# EAGLE design cactar (EAGLE 6.5.0)
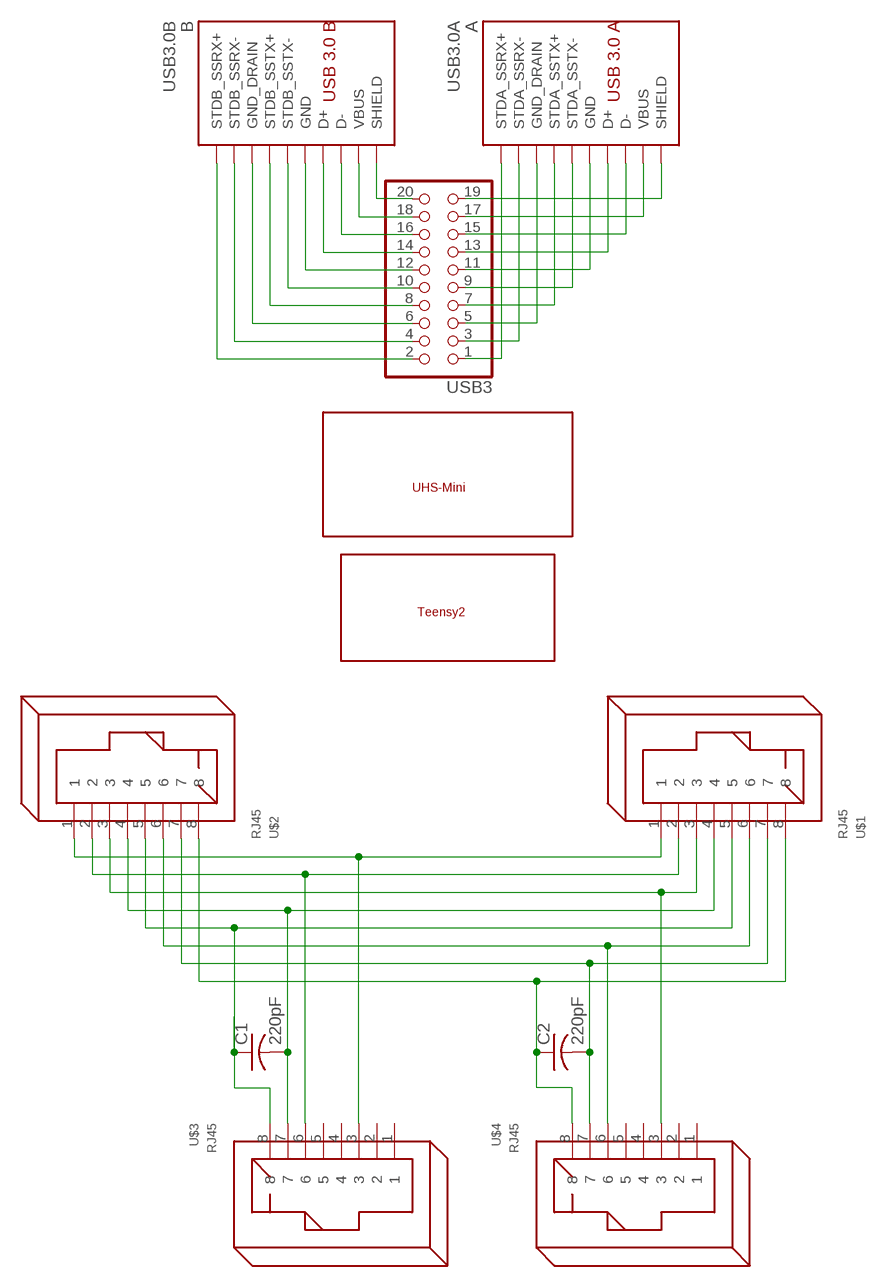
[diagram p0: schematic, sheet 1]

## Parts
_1  TEENSY2  [TEENSY2]
A  USB3.0A  [AMPHENOLUSB3.0A]
B  USB3.0B  [AMPHENOLUSB3.0B]
C1  220pF  C-US050-025X075  [C050-025X075]
C2  220pF  C-US050-025X075  [C050-025X075]
U$1  RJ45  [RJ45]
U$2  RJ45  [RJ45]
U$3  RJ45  [RJ45]
U$4  RJ45  [RJ45]
U$5  BREADLY  [BREADLY]
USB3  PINHD-2X102X10/MIRROR  [2X10/MIRROR]

## Nets
N$1: U$1.1 U$2.1 U$3.3
N$2: U$1.2 U$2.2 U$3.6
N$3: U$1.3 U$2.3 U$4.3
N$4: C1.2 U$1.4 U$2.4 U$3.7
N$5: C1.1 U$1.5 U$2.5 U$3.8
N$6: U$1.6 U$2.6 U$4.6
N$7: C2.2 U$1.7 U$2.7 U$4.7
N$8: C2.1 U$1.8 U$2.8 U$4.8
N$9 [power]: B.10@1(SHIELD) B.10@2(SHIELD) USB3.20
N$20 [power]: A.10@1(SHIELD) A.10@2(SHIELD) USB3.19
N$22 [power]: A.1(VBUS) USB3.17
N$23: A.2(D-) USB3.15
N$24: A.3(D+) USB3.13
N$25 [power]: A.4(GND) USB3.11
N$26: A.8(STDA_SSTX-) USB3.9
N$27: A.9(STDA_SSTX+) USB3.7
N$28: A.7(GND_DRAIN) USB3.5
N$29: A.5(STDA_SSRX-) USB3.3
N$30: A.6(STDA_SSRX+) USB3.1
N$31: B.9(STDB_SSRX+) USB3.2
N$32: B.8(STDB_SSRX-) USB3.4
N$33: B.7(GND_DRAIN) USB3.6
N$34: B.6(STDB_SSTX+) USB3.8
N$35: B.5(STDB_SSTX-) USB3.10
N$36 [power]: B.4(GND) USB3.12
N$37: B.3(D+) USB3.14
N$38: B.2(D-) USB3.16
N$39 [power]: B.1(VBUS) USB3.18
Unconnected: U$3.1 U$3.2 U$3.4 U$3.5 U$4.1 U$4.2 U$4.4 U$4.5

## Library data of the parts
_1 = teensy:TEENSY2
A = AlexW-Eagle-Libraries:USB3.0A: Usb3.0A Amphenol USB 3.0 A jack
B = AlexW-Eagle-Libraries:USB3.0B: USB3.0B Amphenol USB 3.0 B connector
C1 C2 = rcl:C-US: CAPACITOR, American symbol
U$1-U$4 = con-rj:RJ45: RJ45 RJ45 jacks side mounted http://www.tycoelectronics.com
U$5 = teensy:BREADLY
USB3 = pinhead:PINHD-2X10: PIN HEADER

## Net classes
0 default: width 0.305 mm
1 power: width 0.61 mm

## Board
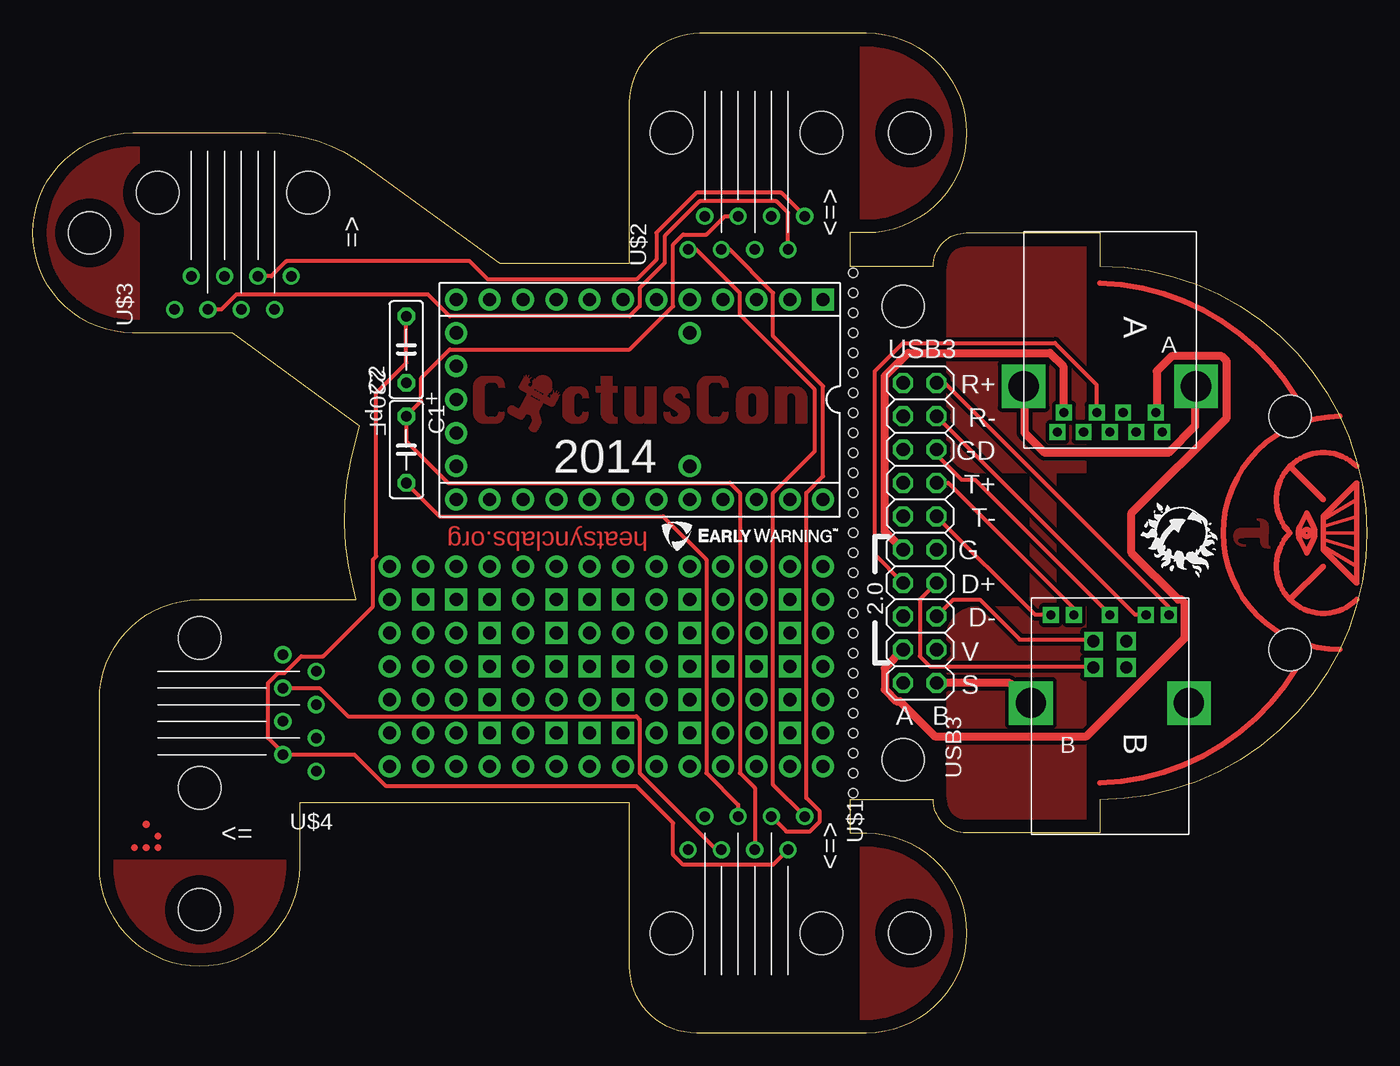
[diagram p1: board, top side]
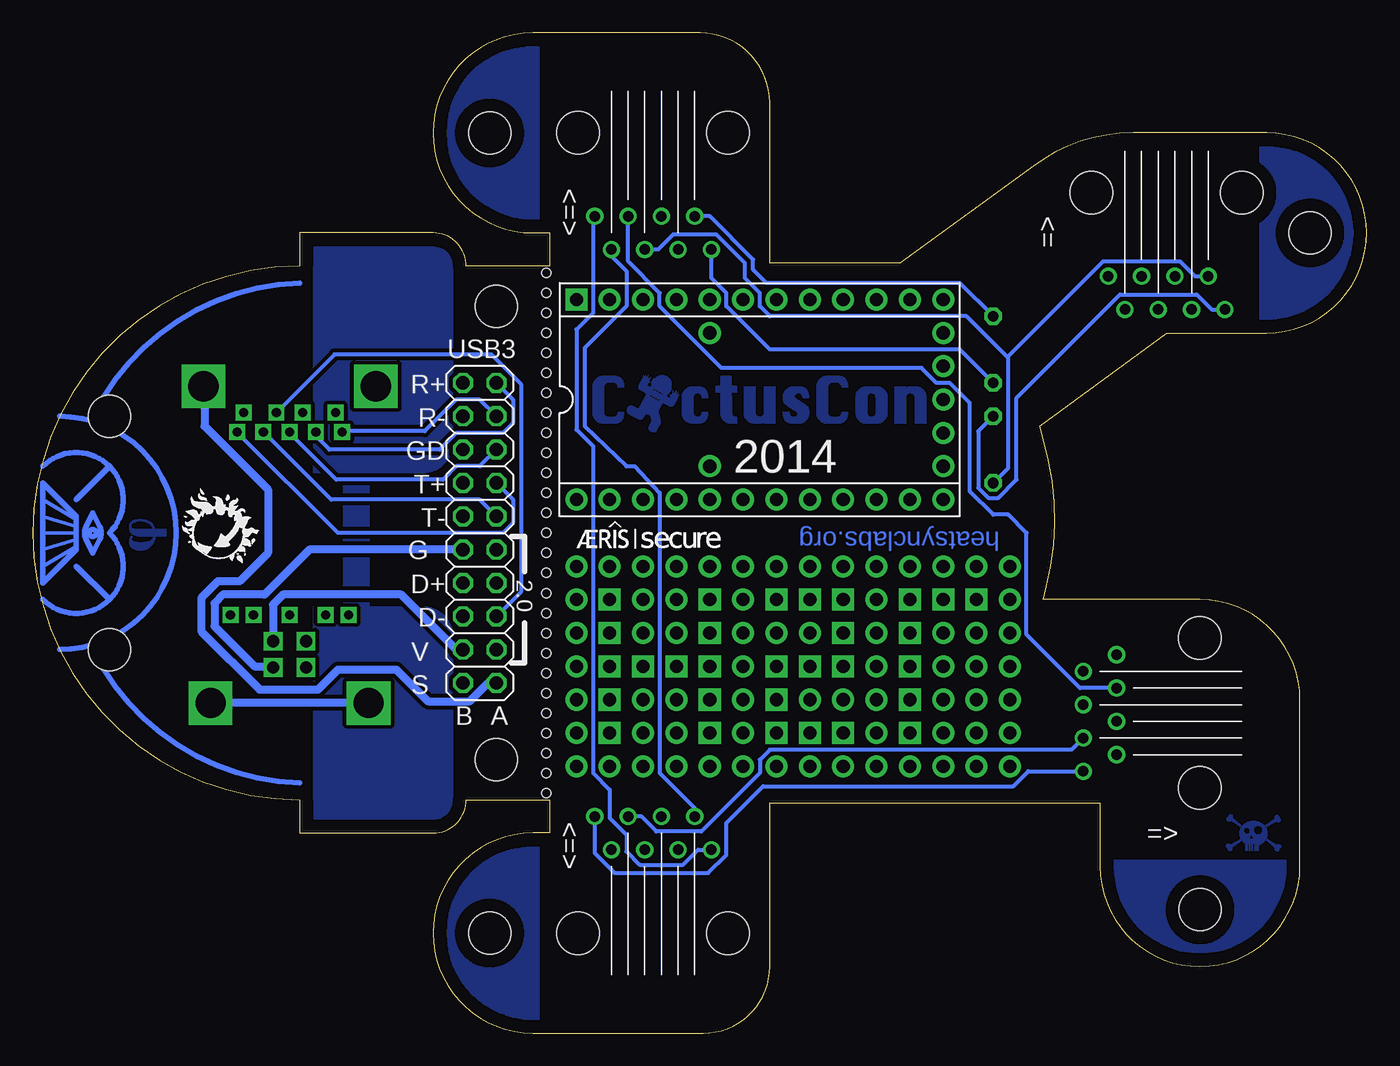
[diagram p2: board, bottom side, seen from below]

Size 101.6 x 76.2 mm. Coordinates in mm from the lower left corner, seen from the top.
Outline: 62.23,58.42 68.58,58.42 arc-90 71.12,60.96 81.28,60.96 81.28,58.42 arc-90 101.6,38.1 arc-90 81.28,17.78 81.28,15.24 71.12,15.24 arc-90 68.58,17.78 62.23,17.78 62.23,15.24 63.5,15.24 arc-90 71.12,7.62 arc-90 63.5,0 50.55,0 arc-90 45.47,5.08 45.47,17.53 20.32,17.53 20.32,12.7 arc-90 12.7,5.08 arc-90 5.08,12.7 5.08,25.4 arc-90 12.7,33.02 24.64,33.02 24.38,34.04 arc-31 24.64,45.21 24.89,46.23 15.24,53.34 7.62,53.34 arc-90 0,60.96 arc-90 7.62,68.58 17.78,68.58 arc-37 25.4,66.04 35.56,58.67 45.47,58.67 45.47,70.87 arc-90 50.8,76.2 63.5,76.2 arc-90 71.12,68.58 arc-90 63.5,60.96 62.23,60.96 62.23,58.42
Copper layers (1*16): Top 0.035mm / dielectric 1.5mm / Bottom 0.035mm
Design rules "default *": minimum track width 12mil, minimum drill 24mil, track to track 12mil, track to pad 10mil, pad to pad 10mil, via to via 12mil, smd to smd 10mil, copper to edge 40mil, drill to drill 8mil, minimum pad ring 10mil, minimum via ring 8mil, stop-mask expansion 4mil, vias tented up to drill 0mil, thermal gap 10mil
Holes 3.2 mm at 4.32,60.96 12.7,9.4 66.8,68.58 66.8,7.62 95.76,46.99 66.29,55.37 66.29,20.83 95.76,29.21
Holes 0.7 mm at 62.48,57.91 62.48,56.39 62.48,54.86 62.48,53.34 62.48,51.82 62.48,50.29 62.48,48.77 62.48,47.24 62.48,45.72 62.48,44.2 62.48,42.67 62.48,41.15 62.48,39.62 62.48,38.1 62.48,36.58 62.48,35.05 62.48,33.53 62.48,32 62.48,30.48 62.48,28.96 62.48,27.43 62.48,25.91 62.48,24.38 62.48,22.86 62.48,21.34 62.48,19.81 62.48,18.29

### Footprints (pad centres in the part's own frame; a part is rotated, then mirrored left to right if it is on the bottom)
TEENSY2 = drill 1 pad 1.676: P$1 11.43,7.62; P$2 8.89,7.62; P$3 6.35,7.62; P$4 3.81,7.62; P$5 1.27,7.62; P$6 -1.27,7.62; P$7 -3.81,7.62; P$8 -6.35,7.62; P$9 -8.89,7.62; P$10 -11.43,7.62; P$11 -13.97,7.62; P$12 13.97,7.62; P$13 13.97,5.08; P$14 13.97,2.54; P$15 13.97,0; P$16 13.97,-2.54; P$17 13.97,-5.08; P$18 13.97,-7.62; P$19 11.43,-7.62; P$20 8.89,-7.62; P$21 6.35,-7.62; P$22 3.81,-7.62; P$23 1.27,-7.62; P$24 -1.27,-7.62; P$25 -3.81,-7.62; P$26 -6.35,-7.62; P$27 -8.89,-7.62; P$28 -11.43,-7.62; P$29 -3.81,-5.08; P$30 -3.81,5.08 | drill 1 pad 1.676 square: P$31 -13.97,-7.62
AMPHENOLUSB3.0A = drill 0.7 square: 1 -3.5,2; 2 -1,2; 3 1,2; 4 3.5,2; 5 4,3.5; 6 2,3.5; 7 0,3.5; 8 -2,3.5; 9 -4,3.5 | drill 2.3 square: 10@1 -6.57,0; 10@2 6.57,0
AMPHENOLUSB3.0B = drill 0.92 square: 1 1.25,4.71; 2 -1.25,4.71; 3 -1.25,2.71; 4 1.25,2.71 | drill 0.7 square: 5 -4.5,6.71; 6 -2.75,6.71; 7 0,6.71; 8 2.75,6.71; 9 4.5,6.71 | drill 2.3 square: 10@1 -6.02,0; 10@2 6.02,0
C050-025X075 = drill 0.813 octagon: 1 -2.54,0; 2 2.54,0
RJ45 = drill 0.8: 1 -6.35,-4.445; 2 -8.89,-3.175; 3 -6.35,-1.905; 4 -8.89,-0.635; 5 -6.35,0.635; 6 -8.89,1.905; 7 -6.35,3.175; 8 -8.89,4.445 | hole 3.25: 0,-5.715; 0,5.715
BREADLY = drill 1 pad 1.676: P$1 17.78,7.62; P$2 15.24,7.62; P$3 12.7,7.62; P$4 10.16,7.62; P$5 7.62,7.62; P$6 5.08,7.62; P$7 2.54,7.62; P$8 0,7.62; P$9 -2.54,7.62; P$10 -5.08,7.62; P$11 -7.62,7.62; P$12 -10.16,7.62; P$13 17.78,-7.62; P$14 15.24,-7.62; P$15 12.7,-7.62; P$16 10.16,-7.62; P$17 7.62,-7.62; P$18 5.08,-7.62; P$19 2.54,-7.62; P$20 0,-7.62; P$21 -2.54,-7.62; P$22 -5.08,-7.62; P$23 -7.62,-7.62; P$24 -10.16,-7.62; P$25 -10.16,2.54; P$26 -7.62,2.54; P$27 0,-2.54; P$28 -2.54,-2.54; P$29 2.54,2.54; P$30 5.08,2.54; P$31 -7.62,5.08; P$32 2.54,-2.54; P$33 12.7,-2.54; P$34 15.24,-2.54; P$35 -2.54,5.08; P$36 12.7,5.08; P$37 15.24,5.08; P$38 -2.54,2.54; P$39 12.7,2.54; P$40 15.24,2.54; P$41 17.78,5.08; P$42 17.78,2.54; P$43 17.78,0; P$44 17.78,-2.54; P$45 -10.16,5.08; P$46 -2.54,0; P$47 -2.54,-5.08; P$48 7.62,5.08; P$49 7.62,2.54; P$50 -7.62,-2.54; P$51 -7.62,-5.08; P$57 -12.7,7.62; P$59 -15.24,7.62; P$60 -15.24,5.08; P$61 -15.24,2.54; P$63 7.62,-5.08; P$70 -10.16,-5.08; P$71 7.62,-2.54; P$78 -10.16,-2.54; P$80 -15.24,-2.54; P$82 -15.24,-5.08; P$83 -12.7,-7.62; P$84 -15.24,-7.62; P$86 12.7,0; P$87 15.24,0; P$88 17.78,-5.08; P$89 7.62,0; P$98 -15.24,0 | drill 1 pad 1.676 square: P$52 -12.7,5.08; P$53 -12.7,2.54; P$54 -12.7,0; P$55 -12.7,-2.54; P$56 -12.7,-5.08; P$58 -10.16,0; P$62 -7.62,0; P$64 -5.08,-5.08; P$65 -5.08,-2.54; P$66 -5.08,0; P$67 -5.08,2.54; P$68 -5.08,5.08; P$69 5.08,5.08; P$72 2.54,5.08; P$73 0,5.08; P$74 0,2.54; P$75 0,0; P$76 2.54,0; P$77 5.08,0; P$79 5.08,-2.54; P$81 5.08,-5.08; P$85 2.54,-5.08; P$90 0,-5.08; P$91 10.16,5.08; P$92 10.16,2.54; P$93 10.16,0; P$94 10.16,-2.54; P$95 10.16,-5.08; P$96 12.7,-5.08; P$97 15.24,-5.08
2X10/MIRROR = drill 1.016 octagon: 1 -11.43,-1.27; 2 -11.43,1.27; 3 -8.89,-1.27; 4 -8.89,1.27; 5 -6.35,-1.27; 6 -6.35,1.27; 7 -3.81,-1.27; 8 -3.81,1.27; 9 -1.27,-1.27; 10 -1.27,1.27; 11 1.27,-1.27; 12 1.27,1.27; 13 3.81,-1.27; 14 3.81,1.27; 15 6.35,-1.27; 16 6.35,1.27; 17 8.89,-1.27; 18 8.89,1.27; 19 11.43,-1.27; 20 11.43,1.27

### Placement (x,y rotation side)
_1  46.23,48.26 180 top
A  82.04,49.28 180 top
B  82.04,25.15 0 top
C1  28.45,44.45 270 top
C2  28.45,52.07 90 top
U$1  54.36,7.62 270 top
U$2  54.36,68.58 90 top
U$3  15.24,64.01 90 top
U$4  12.7,24.38 180 top
U$5  44.96,27.94 180 top
USB3  67.56,38.1 270 top

### Tracks (layer width: path | path; a pad name or v marks a point on that pad's centre or on a via)
N$1
  Top 0.305: U$3.3 18.16,57.66 19.3,58.8 33.27,58.8 34.67,57.4 45.97,57.4 47.5,58.93 47.5,60.96 50.55,64.01 57.02,64.01 U$2.1
  Bottom 0.305: U$1.1 50.93,13.97 52.07,12.83 55.37,12.83 56.39,13.84 56.39,15.11 57.66,16.38 57.66,18.54 58.93,19.81 58.93,44.7 60.2,45.97 60.2,53.59 58.93,54.86 58.93,62.1 U$2.1
N$2
  Top 0.305: U$3.6 14.35,55.12 15.49,56.26 30.1,56.26 31.75,54.61 45.47,54.61 46.23,55.37 46.23,56.77 48.13,58.67 48.13,60.71 50.8,63.37 56.64,63.37 57.53,62.48 U$2.2
  Bottom 0.305: U$1.2 51.18,17.14 53.85,19.81 53.85,41.15 55.75,43.18 56.39,43.18 59.56,46.23 59.56,52.2 56.39,55.37 56.39,58.04 57.53,59.18 U$2.2
N$3
  Top 0.305: U$1.3 52.07,13.97 46.23,19.81 46.23,23.88 45.97,24.13 24,24.13 21.84,26.29 U$4.3
  Bottom 0.305: U$2.3 56.26,58.8 53.85,56.39 53.85,55.37 49.15,50.67 33.91,50.67 32.77,49.53 31.75,49.53 30.23,48.01 30.23,41.27 28.45,39.5 27.3,39.5 25.91,38.1 25.91,30.35 21.84,26.29 U$4.3
N$4
  Top 0.305: U$1.4 53.72,17.4 51.31,19.81 51.31,36.07 48.01,39.37 30.99,39.37 C1.2
  Bottom 0.305: U$3.7 13.08,57.66 14.22,58.8 20.07,58.8 27.3,51.56 | 27.3,51.56 27.3,43.05 C1.2 | U$2.4 53.97,59.69 52.83,60.83 49.53,60.83 47.37,58.67 47.37,57.53 46.23,56.39 46.23,55.37 45.47,54.61 30.48,54.61 27.43,51.56 27.3,51.56
N$5
  Top 0.305: U$2.5 52.7,62.23 51.31,60.83 49.53,60.83 48.77,60.07 48.77,55.37 45.47,52.07 31.75,52.07 29.59,49.91 29.59,48.13 C1.1 28.45,45.08 31.62,41.91 53.09,41.91 53.85,41.15 53.85,19.81 54.99,18.67 U$1.5
  Bottom 0.305: U$3.8 11.81,55.12 12.95,56.26 18.8,56.26 26.67,48.39 26.67,42.16 28.07,40.77 28.83,40.77 29.59,41.53 29.59,45.85 C1.1
N$6
  Top 0.305: U$2.6 53.09,59.69 56.39,56.39 56.39,53.09 60.2,49.28 60.2,42.42 58.93,41.15 58.93,17.91 59.94,16.89 59.94,16.13 59.18,15.37 57.4,15.37 U$1.6
  Bottom 0.305: U$1.6 55.24,16.51 54.1,15.37 50.67,15.37 46.23,19.81 46.23,20.83 45.47,21.59 22.48,21.59 U$4.6
N$7
  Top 0.305: U$1.7 56.39,12.83 49.53,12.83 48.77,13.59 48.77,16 45.97,18.8 26.92,18.8 24.51,21.21 U$4.7 19.05,21.34 17.91,22.48 17.91,26.67 18.67,27.43 19.18,27.43 20.45,28.7 22.1,28.7 25.91,32.51 25.91,36.07 26.16,36.32 26.16,48.77 28.45,51.05 C2.2
  Bottom 0.305: U$2.7 50.04,62.23 46.74,58.93 46.74,58.17 45.72,57.15 30.99,57.15 C2.2
N$8
  Top 0.305: U$2.8 50.55,59.69 53.85,56.39 53.85,54.74 59.56,49.02 59.56,44.32 56.39,41.15 56.39,18.92 U$1.8
  Bottom 0.305: U$2.8 49.91,57.53 48.77,56.39 48.77,55.37 45.47,52.07 30.99,52.07 C2.1 | U$4.8 25.78,19.94 26.92,18.8 45.97,18.8 48.77,16 48.77,13.59 50.16,12.19 57.28,12.19 58.8,13.72 U$1.8
N$9
  Top 0.61: USB3.20 74.42,26.67 75.95,25.15 B.10@1
  Bottom 0.61: B.10@1 B.10@2
N$10
  Bottom 0.406: 95.76,38.1 arc-90 95.76,43.18 | 95.76,43.18 arc-90 100.84,43.18 | 95.76,43.18 98.3,40.64
N$11
  Bottom 0.406: 100.84,33.02 arc-90 95.76,33.02 | 95.76,33.02 arc-90 95.76,38.1 | 95.76,33.02 98.3,35.56
N$12
  Top 0.406: 95.76,38.1 arc-90 95.76,43.18 | 95.76,43.18 arc-90 100.84,43.18 | 95.76,43.18 98.3,40.64
N$13
  Top 0.406: 100.84,33.02 arc-90 95.76,33.02 | 95.76,33.02 arc-90 95.76,38.1 | 95.76,33.02 98.3,35.56
N$14
  pour Bottom: 80.26,60.2 71.37,60.2 arc90 69.6,58.42 69.6,44.96 arc90 71.88,42.67 75.95,42.67 75.95,32.51 71.88,32.51 arc90 69.6,30.23 69.6,17.78 arc90 71.37,16 80.26,16 80.26,32.51 77.98,32.51 77.98,42.67 80.26,42.67
  pour Top: 80.26,60.2 71.37,60.2 arc90 69.6,58.42 69.6,44.96 arc90 71.88,42.67 75.95,42.67 75.95,32.51 71.88,32.51 arc90 69.6,30.23 69.6,17.78 arc90 71.37,16 80.26,16 80.26,32.51 77.98,32.51 77.98,42.67 80.26,42.67
N$18
  pour Bottom: 62.99,61.72 63.5,61.72 arc90 70.36,68.58 arc94 62.99,75.44
  pour Top: 62.99,61.72 63.5,61.72 arc90 70.36,68.58 arc94 62.99,75.44
N$19
  pour Bottom: 8.13,67.82 7.62,67.82 arc90 0.76,60.96 arc94 8.13,54.1
  pour Top: 8.13,67.82 7.62,67.82 arc90 0.76,60.96 arc94 8.13,54.1
N$20
  Top 0.61: A.10@2 75.56,49.28 75.56,45.72 77.09,44.2 86.49,44.2 88.52,46.23 88.52,49.28 A.10@1
  Bottom 0.61: USB3.19 66.93,26.67 68.33,25.27 71.5,25.27 73.91,27.69 78.36,27.69 79.88,26.16 84.33,26.16 88.77,30.61 88.77,33.15 87.5,34.42 85.85,34.42 83.69,36.58 83.69,41.4 88.52,46.23 88.52,49.28 A.10@1
N$22
  Top 0.61: USB3.17 64.9,27.81 64.9,26.16 65.79,25.27 66.04,25.27 68.71,22.61 80.26,22.61 87.76,30.1 87.76,32.77 87.5,33.02 87.25,33.02 83.69,36.58 83.69,39.62 90.93,46.86 90.93,51.18 90.55,51.56 86.74,51.56 85.6,50.42 85.6,47.37 A.1
N$23
  Bottom 0.305: USB3.15 64.39,33.66 64.39,49.4 66.67,51.69 78.61,51.69 82.93,47.37 A.2
N$24
  Top 0.305: USB3.13 64.14,36.45 64.14,50.42 66.29,52.58 77.85,52.58 81.03,49.4 81.03,47.37 A.3
N$25
  Top 0.61: USB3.11 64.9,38.23 64.9,50.04 66.67,51.82 77.47,51.82 78.49,50.8 78.49,47.37 A.4
N$26
  Bottom 0.305: USB3.9 67.56,40.64 78.87,40.64 83.95,45.72 A.8
N$27
  Bottom 0.305: USB3.7 65.02,40.64 65.02,38.86 65.79,38.1 78.36,38.1 85.98,45.72 A.9
N$28
  Bottom 0.305: USB3.5 67.56,43.18 69.34,43.18 70.36,42.16 78.49,42.16 82.04,45.72 A.7
N$29
  Bottom 0.305: USB3.3 67.56,48.26 69.34,48.26 71.76,45.85 77.98,45.85 A.5
N$30
  Bottom 0.305: USB3.1 65.02,48.26 65.02,46.48 65.79,45.72 69.34,45.72 70.61,44.45 78.99,44.45 80.01,45.47 80.01,45.72 A.6
N$31
  Top 0.305: USB3.2 69.47,49.53 86.49,32.51 86.49,31.88 B.9
N$32
  Top 0.305: USB3.4 83.95,31.88 84.71,31.88 B.8
N$33
  Top 0.305: USB3.6 68.83,44.07 70.74,42.16 71.76,42.16 82.04,31.88 B.7
N$34
  Top 0.305: USB3.8 69.72,41.91 79.25,32.39 79.25,31.88 B.6
N$35
  Top 0.305: USB3.10 76.33,31.88 77.47,31.88 B.5
N$36
  Bottom 0.61: USB3.12 80.52,36.83 83.95,33.4 87.12,33.4 87.76,32.77 87.76,30.99 84.71,27.94 83.31,27.94 B.4
N$37
  Top 0.305: USB3.14 67.56,33.02 67.56,28.7 68.33,27.94 80.77,27.94 B.3
N$38
  Top 0.305: USB3.16 70.1,33.02 72.14,33.02 75.18,29.97 80.77,29.97 B.2
N$39
  Bottom 0.61: USB3.18 69.34,29.21 73.53,33.4 82.55,33.4 83.31,32.64 83.31,29.97 B.1
N$40
  pour Bottom: 5.84,13.21 5.84,12.7 arc90 12.7,5.84 arc94 19.56,13.21
  pour Top: 5.84,13.21 5.84,12.7 arc90 12.7,5.84 arc94 19.56,13.21
N$41
  pour Bottom: 62.99,0.76 63.5,0.76 arc90 70.36,7.62 arc94 62.99,14.48
  pour Top: 62.99,0.76 63.5,0.76 arc90 70.36,7.62 arc94 62.99,14.48
N$42
  Bottom 0.406: 96.52,38.61 97.03,39.62 97.54,38.61 arc-53 97.54,37.59 97.03,36.58 96.52,37.59 arc-53 96.52,38.61
N$43  (1 unrouted)
  Top 0.406: 99.57,46.99 arc180 99.57,29.21
  Bottom 0.406: 99.57,46.99 arc180 99.57,29.21
N$44  (1 unrouted)
  Top 0.406: 81.28,57.15 arc-62 97.03,46.99
  Bottom 0.406: 81.28,57.15 arc-62 97.03,46.99
N$45  (1 unrouted)
  Top 0.406: 81.28,19.05 arc62 97.03,29.21
  Bottom 0.406: 81.28,19.05 arc62 97.03,29.21
N$46
  Bottom 0.254: 98.3,39.12 100.84,40.64 | 98.3,38.61 100.84,39.37 | 98.3,38.1 100.84,38.1 | 98.3,37.59 100.84,36.83 | 98.3,37.08 100.84,35.56
  Bottom 0.406: 100.84,41.91 100.84,40.64 100.84,39.37 100.84,38.1 100.84,36.83 100.84,35.56 100.84,34.29 98.3,36.83 98.3,37.08 98.3,37.59 98.3,38.1 98.3,38.61 98.3,39.12 98.3,39.37 100.84,41.91
N$47
  Top 0.254: 98.3,38.1 100.84,38.1 | 98.3,37.59 100.84,36.83 | 98.3,37.08 100.84,35.56 | 98.3,38.61 100.84,39.37 | 98.3,39.12 100.84,40.64
  Top 0.406: 100.84,41.91 100.84,40.64 100.84,39.37 100.84,38.1 100.84,36.83 100.84,35.56 100.84,34.29 98.3,36.83 98.3,37.08 98.3,37.59 98.3,38.1 98.3,38.61 98.3,39.12 98.3,39.37 100.84,41.91
N$48
  Top 0.406: 96.52,38.61 97.03,39.62 97.54,38.61 arc-53 97.54,37.59 97.03,36.58 96.52,37.59 arc-53 96.52,38.61
N$49
  pour Bottom: 451 corners
N$50
  pour Bottom: 869 corners
N$51
  pour Top: 331 corners
N$52
  pour Bottom: 567 corners
N$53
  pour Bottom: 49.23,50.06 49.23,49.29 49.6,49.29 49.6,48.79 49.23,48.79 49.23,47.84 49.23,47.82 49.23,47.74 49.23,47.72 49.23,47.68 49.23,47.66 49.23,47.62 49.23,47.6 49.23,47.55 49.23,47.53 49.23,47.51 49.23,47.49 49.23,47.47 49.23,47.43 49.23,47.41 49.23,47.39 49.23,47.37 49.23,47.35 49.23,47.33 49.23,47.3 49.23,47.28 49.23,47.26 49.23,47.24 49.23,47.22 49.22,47.2 49.22,47.18 49.22,47.16 49.22,47.14 49.22,47.12 49.22,47.1 49.21,47.08 49.21,47.06 49.2,47.04 49.2,47.02 49.19,47 49.18,46.98 49.17,46.96 49.17,46.94 49.16,46.93 49.15,46.91 49.14,46.89 49.13,46.87 49.12,46.85 49.11,46.83 49.1,46.82 49.09,46.8 49.08,46.78 49.07,46.77 49.05,46.75 49.04,46.74 49.03,46.72 49.01,46.7 49,46.69 48.99,46.68 48.97,46.66 48.96,46.65 48.94,46.63 48.93,46.62 48.91,46.61 48.89,46.59 48.88,46.58 48.86,46.57 48.84,46.56 48.83,46.55 48.81,46.54 48.79,46.53 48.77,46.52 48.76,46.51 48.74,46.5 48.72,46.49 48.7,46.48 48.68,46.47 48.66,46.47 48.64,46.46 48.62,46.45 48.6,46.45 48.58,46.44 48.56,46.44 48.54,46.44 48.52,46.44 48.5,46.44 48.48,46.44 48.46,46.44 48.44,46.44 48.42,46.43 48.4,46.43 48.38,46.43 48.36,46.43 48.34,46.43 48.32,46.43 48.3,46.43 48.28,46.43 48.26,46.43 48.18,46.43 48.16,46.43 48.1,46.43 48.08,46.43 48,46.43 47.98,46.43 47.98,46.93 48,46.93 48.02,46.93 48.03,46.93 48.05,46.93 48.07,46.94 48.09,46.94 48.11,46.94 48.13,46.94 48.15,46.95 48.17,46.96 48.19,46.97 48.21,46.98 48.22,46.99 48.24,47 48.25,47.02 48.27,47.03 48.28,47.05 48.29,47.06 48.3,47.08 48.31,47.1 48.32,47.11 48.34,47.12 48.35,47.14 48.36,47.15 48.36,47.19 48.36,47.21 48.36,47.28 48.36,47.3 48.36,47.36 48.36,47.38 48.36,47.46 48.36,47.48 48.36,47.54 48.36,47.56 48.36,47.62 48.36,47.64 48.36,47.73 48.36,47.75 48.36,47.81 48.36,47.83 48.36,47.89 48.36,47.91 48.36,47.99 48.36,48.01 48.36,48.07 48.36,48.09 48.36,48.18 48.36,48.2 48.36,48.26 48.36,48.28 48.36,48.36 48.36,48.38 48.36,48.44 48.36,48.46 48.36,48.53 48.36,48.55 48.36,48.63 48.36,48.65 48.36,48.71 48.36,48.73 48.36,48.79 47.98,48.79 47.98,49.29 48.36,49.29 48.36,50.06
N$54
  pour Bottom: 47.44,49.26 47.44,47.79 47.44,47.77 47.44,47.65 47.44,47.63 47.44,47.57 47.44,47.55 47.44,47.53 47.44,47.51 47.44,47.48 47.44,47.46 47.44,47.44 47.44,47.42 47.44,47.4 47.44,47.38 47.44,47.36 47.44,47.34 47.44,47.32 47.44,47.3 47.44,47.28 47.43,47.26 47.43,47.24 47.43,47.22 47.43,47.19 47.43,47.17 47.43,47.15 47.43,47.13 47.42,47.11 47.42,47.09 47.42,47.07 47.41,47.05 47.41,47.03 47.4,47.01 47.4,46.99 47.39,46.97 47.38,46.95 47.38,46.93 47.37,46.91 47.36,46.9 47.35,46.88 47.34,46.86 47.33,46.84 47.32,46.83 47.31,46.81 47.29,46.8 47.28,46.78 47.27,46.77 47.26,46.75 47.25,46.74 47.23,46.72 47.22,46.71 47.21,46.69 47.18,46.66 47.15,46.64 47.13,46.62 47.12,46.61 47.1,46.6 47.09,46.59 47.07,46.57 47.05,46.56 47.04,46.55 47.02,46.54 47,46.53 46.99,46.52 46.97,46.51 46.95,46.5 46.93,46.49 46.91,46.49 46.89,46.48 46.88,46.47 46.86,46.47 46.84,46.46 46.82,46.46 46.8,46.45 46.78,46.45 46.76,46.44 46.74,46.44 46.72,46.44 46.7,46.44 46.68,46.44 46.66,46.44 46.64,46.44 46.62,46.43 46.6,46.43 46.58,46.43 46.56,46.43 46.54,46.43 46.52,46.43 46.5,46.43 46.46,46.43 46.44,46.43 46.37,46.43 46.35,46.43 46.31,46.43 46.29,46.43 46.27,46.43 46.25,46.43 46.23,46.43 46.21,46.43 46.18,46.44 46.16,46.44 46.14,46.44 46.12,46.44 46.1,46.45 46.08,46.45 46.06,46.46 46.04,46.46 46.02,46.47 46,46.48 45.99,46.49 45.97,46.5 45.95,46.51 45.93,46.53 45.92,46.54 45.9,46.55 45.9,46.43 45.01,46.43 45.01,49.26 45.9,49.26 45.9,47.19 45.91,47.17 45.92,47.15 45.93,47.13 45.94,47.12 45.95,47.1 45.96,47.08 45.97,47.07 45.98,47.05 45.99,47.04 46.01,47.03 46.02,47.01 46.03,47 46.05,46.99 46.07,46.98 46.08,46.97 46.1,46.96 46.12,46.95 46.13,46.95 46.15,46.94 46.17,46.94 46.19,46.94 46.21,46.94 46.23,46.94 46.25,46.94 46.27,46.94 46.28,46.94 46.3,46.94 46.32,46.95 46.34,46.95 46.36,46.96 46.37,46.97 46.39,46.98 46.41,46.99 46.42,47 46.44,47.01 46.45,47.03 46.46,47.04 46.47,47.05 46.49,47.07 46.5,47.08 46.51,47.1 46.52,47.12 46.53,47.13 46.54,47.15 46.55,47.17 46.55,47.19 46.55,49.26
N$55
  pour Bottom: 487 corners
N$56
  pour Bottom: 489 corners
N$57
  pour Bottom: 272 corners
N$58
  pour Bottom: 35.97,49.26 35.97,46.43 35.08,46.43 35.08,48.5 35.07,48.52 35.06,48.54 35.05,48.56 35.04,48.57 35.03,48.59 35.02,48.61 35.01,48.62 35,48.64 34.99,48.65 34.98,48.66 34.96,48.68 34.95,48.69 34.93,48.7 34.92,48.71 34.9,48.72 34.88,48.73 34.87,48.74 34.85,48.74 34.83,48.75 34.81,48.75 34.79,48.75 34.77,48.75 34.74,48.75 34.72,48.75 34.7,48.75 34.68,48.75 34.66,48.74 34.64,48.74 34.62,48.73 34.61,48.72 34.59,48.71 34.58,48.7 34.56,48.69 34.55,48.68 34.53,48.66 34.52,48.65 34.51,48.64 34.5,48.62 34.48,48.61 34.47,48.59 34.47,48.57 34.46,48.56 34.45,48.54 34.44,48.52 34.43,48.5 34.43,46.43 33.54,46.43 33.54,47.87 33.54,47.9 33.54,48.04 33.54,48.06 33.54,48.1 33.54,48.12 33.54,48.16 33.54,48.19 33.54,48.21 33.54,48.23 33.54,48.25 33.54,48.27 33.54,48.29 33.54,48.31 33.54,48.33 33.54,48.35 33.55,48.37 33.55,48.39 33.55,48.41 33.55,48.43 33.55,48.45 33.55,48.47 33.55,48.49 33.55,48.52 33.55,48.54 33.56,48.56 33.56,48.58 33.56,48.6 33.56,48.62 33.57,48.64 33.57,48.66 33.58,48.68 33.58,48.7 33.59,48.72 33.6,48.74 33.61,48.76 33.62,48.77 33.62,48.79 33.63,48.81 33.64,48.83 33.65,48.85 33.66,48.86 33.68,48.88 33.69,48.9 33.7,48.92 33.71,48.93 33.73,48.95 33.74,48.96 33.75,48.98 33.77,48.99 33.78,49.01 33.8,49.02 33.81,49.04 33.83,49.05 33.84,49.06 33.86,49.08 33.87,49.09 33.89,49.1 33.91,49.11 33.92,49.13 33.94,49.14 33.96,49.15 33.98,49.16 33.99,49.17 34.01,49.18 34.03,49.19 34.05,49.19 34.07,49.2 34.09,49.21 34.11,49.22 34.13,49.22 34.15,49.23 34.17,49.23 34.19,49.24 34.21,49.24 34.23,49.25 34.25,49.25 34.27,49.25 34.29,49.25 34.31,49.25 34.33,49.26 34.35,49.26 34.37,49.26 34.39,49.26 34.42,49.26 34.54,49.26 34.56,49.26 34.58,49.26 34.6,49.26 34.62,49.26 34.64,49.26 34.66,49.26 34.68,49.26 34.7,49.26 34.72,49.26 34.74,49.25 34.77,49.25 34.79,49.25 34.81,49.25 34.83,49.25 34.85,49.25 34.87,49.25 34.89,49.25 34.91,49.25 34.93,49.24 34.94,49.23 34.96,49.22 34.98,49.21 34.99,49.2 35.01,49.19 35.03,49.18 35.05,49.17 35.06,49.15 35.08,49.14 35.08,49.26
N$59
  pour Bottom: 283 corners
N$60
  pour Bottom: 697 corners
N$61
  pour Bottom: 607 corners
N$62
  pour Bottom: 515 corners
N$63
  pour Top: 567 corners
N$64
  pour Top: 43.27,50.06 43.27,49.29 42.9,49.29 42.9,48.79 43.27,48.79 43.27,47.84 43.27,47.82 43.27,47.74 43.27,47.72 43.27,47.68 43.27,47.66 43.27,47.62 43.27,47.6 43.27,47.55 43.27,47.53 43.27,47.51 43.28,47.49 43.28,47.47 43.28,47.43 43.28,47.41 43.28,47.39 43.28,47.37 43.28,47.35 43.28,47.33 43.28,47.3 43.28,47.28 43.28,47.26 43.28,47.24 43.28,47.22 43.28,47.2 43.28,47.18 43.28,47.16 43.28,47.14 43.29,47.12 43.29,47.1 43.29,47.08 43.3,47.06 43.3,47.04 43.31,47.02 43.32,47 43.32,46.98 43.33,46.96 43.34,46.94 43.35,46.93 43.36,46.91 43.36,46.89 43.37,46.87 43.38,46.85 43.39,46.83 43.4,46.82 43.42,46.8 43.43,46.78 43.44,46.77 43.45,46.75 43.47,46.74 43.48,46.72 43.49,46.7 43.51,46.69 43.52,46.68 43.54,46.66 43.55,46.65 43.57,46.63 43.58,46.62 43.6,46.61 43.61,46.59 43.63,46.58 43.65,46.57 43.66,46.56 43.68,46.55 43.7,46.54 43.72,46.53 43.73,46.52 43.75,46.51 43.77,46.5 43.79,46.49 43.81,46.48 43.83,46.47 43.84,46.47 43.86,46.46 43.88,46.45 43.9,46.45 43.92,46.44 43.94,46.44 43.96,46.44 43.98,46.44 44,46.44 44.02,46.44 44.04,46.44 44.07,46.44 44.09,46.43 44.11,46.43 44.13,46.43 44.15,46.43 44.17,46.43 44.19,46.43 44.21,46.43 44.23,46.43 44.25,46.43 44.33,46.43 44.35,46.43 44.41,46.43 44.43,46.43 44.51,46.43 44.53,46.43 44.53,46.93 44.51,46.93 44.49,46.93 44.47,46.93 44.45,46.93 44.44,46.94 44.42,46.94 44.4,46.94 44.37,46.94 44.36,46.95 44.34,46.96 44.32,46.97 44.3,46.98 44.28,46.99 44.27,47 44.25,47.02 44.24,47.03 44.23,47.05 44.21,47.06 44.2,47.08 44.19,47.1 44.18,47.11 44.17,47.12 44.16,47.14 44.15,47.15 44.15,47.19 44.15,47.21 44.15,47.28 44.15,47.3 44.15,47.36 44.15,47.38 44.15,47.46 44.15,47.48 44.15,47.54 44.15,47.56 44.15,47.62 44.15,47.64 44.15,47.73 44.15,47.75 44.15,47.81 44.15,47.83 44.15,47.89 44.15,47.91 44.15,47.99 44.15,48.01 44.15,48.07 44.15,48.09 44.15,48.18 44.15,48.2 44.15,48.26 44.14,48.28 44.14,48.36 44.14,48.38 44.14,48.44 44.14,48.46 44.14,48.53 44.14,48.55 44.14,48.63 44.14,48.65 44.14,48.71 44.14,48.73 44.14,48.79 44.53,48.79 44.53,49.29 44.14,49.29 44.14,50.06
N$65
  pour Top: 45.06,49.26 45.06,47.79 45.07,47.77 45.07,47.65 45.07,47.63 45.07,47.57 45.07,47.55 45.07,47.53 45.07,47.51 45.07,47.48 45.07,47.46 45.07,47.44 45.07,47.42 45.07,47.4 45.07,47.38 45.07,47.36 45.07,47.34 45.07,47.32 45.07,47.3 45.07,47.28 45.07,47.26 45.07,47.24 45.07,47.22 45.08,47.19 45.08,47.17 45.08,47.15 45.08,47.13 45.08,47.11 45.09,47.09 45.09,47.07 45.09,47.05 45.1,47.03 45.1,47.01 45.11,46.99 45.12,46.97 45.12,46.95 45.13,46.93 45.14,46.91 45.15,46.9 45.16,46.88 45.17,46.86 45.18,46.84 45.19,46.83 45.2,46.81 45.21,46.8 45.22,46.78 45.24,46.77 45.25,46.75 45.26,46.74 45.27,46.72 45.29,46.71 45.3,46.69 45.33,46.66 45.36,46.64 45.37,46.62 45.39,46.61 45.4,46.6 45.42,46.59 45.44,46.57 45.45,46.56 45.47,46.55 45.49,46.54 45.5,46.53 45.52,46.52 45.54,46.51 45.56,46.5 45.57,46.49 45.59,46.49 45.61,46.48 45.63,46.47 45.65,46.47 45.67,46.46 45.69,46.46 45.71,46.45 45.73,46.45 45.75,46.44 45.77,46.44 45.79,46.44 45.81,46.44 45.83,46.44 45.85,46.44 45.87,46.44 45.89,46.43 45.91,46.43 45.93,46.43 45.95,46.43 45.97,46.43 45.99,46.43 46.01,46.43 46.05,46.43 46.07,46.43 46.13,46.43 46.16,46.43 46.2,46.43 46.22,46.43 46.24,46.43 46.26,46.43 46.28,46.43 46.3,46.43 46.32,46.44 46.34,46.44 46.36,46.44 46.38,46.44 46.41,46.45 46.43,46.45 46.45,46.46 46.47,46.46 46.48,46.47 46.5,46.48 46.52,46.49 46.54,46.5 46.56,46.51 46.57,46.53 46.59,46.54 46.61,46.55 46.61,46.43 47.49,46.43 47.49,49.26 46.61,49.26 46.61,47.19 46.6,47.17 46.59,47.15 46.58,47.13 46.57,47.12 46.56,47.1 46.55,47.08 46.54,47.07 46.53,47.05 46.51,47.04 46.5,47.03 46.49,47.01 46.47,47 46.46,46.99 46.44,46.98 46.43,46.97 46.41,46.96 46.39,46.95 46.37,46.95 46.35,46.94 46.34,46.94 46.32,46.94 46.3,46.94 46.28,46.94 46.26,46.94 46.24,46.94 46.22,46.94 46.2,46.94 46.18,46.95 46.17,46.95 46.15,46.96 46.13,46.97 46.12,46.98 46.1,46.99 46.09,47 46.07,47.01 46.06,47.03 46.04,47.04 46.03,47.05 46.02,47.07 46.01,47.08 46,47.1 45.99,47.12 45.98,47.13 45.97,47.15 45.96,47.17 45.95,47.19 45.95,49.26
N$66
  pour Top: 487 corners
N$67
  pour Top: 489 corners
N$68
  pour Top: 272 corners
N$69
  pour Top: 56.54,49.26 56.54,46.43 57.43,46.43 57.43,48.5 57.44,48.52 57.44,48.54 57.45,48.56 57.46,48.57 57.47,48.59 57.48,48.61 57.49,48.62 57.51,48.64 57.52,48.65 57.53,48.66 57.54,48.68 57.56,48.69 57.57,48.7 57.59,48.71 57.61,48.72 57.62,48.73 57.64,48.74 57.66,48.74 57.68,48.75 57.7,48.75 57.71,48.75 57.73,48.75 57.77,48.75 57.79,48.75 57.81,48.75 57.83,48.75 57.85,48.74 57.87,48.74 57.88,48.73 57.9,48.72 57.92,48.71 57.93,48.7 57.95,48.69 57.96,48.68 57.97,48.66 57.99,48.65 58,48.64 58.01,48.62 58.02,48.61 58.03,48.59 58.04,48.57 58.05,48.56 58.06,48.54 58.07,48.52 58.08,48.5 58.08,46.43 58.97,46.43 58.97,47.87 58.97,47.9 58.97,48.04 58.97,48.06 58.97,48.1 58.97,48.12 58.97,48.16 58.96,48.19 58.96,48.21 58.96,48.23 58.96,48.25 58.96,48.27 58.96,48.29 58.96,48.31 58.96,48.33 58.96,48.35 58.96,48.37 58.96,48.39 58.96,48.41 58.96,48.43 58.96,48.45 58.96,48.47 58.96,48.49 58.95,48.52 58.95,48.54 58.95,48.56 58.95,48.58 58.95,48.6 58.94,48.62 58.94,48.64 58.93,48.66 58.93,48.68 58.92,48.7 58.92,48.72 58.91,48.74 58.9,48.76 58.89,48.77 58.88,48.79 58.87,48.81 58.86,48.83 58.85,48.85 58.84,48.86 58.83,48.88 58.82,48.9 58.81,48.92 58.79,48.93 58.78,48.95 58.77,48.96 58.75,48.98 58.74,48.99 58.72,49.01 58.71,49.02 58.69,49.04 58.68,49.05 58.66,49.06 58.65,49.08 58.63,49.09 58.62,49.1 58.6,49.11 58.58,49.13 58.57,49.14 58.55,49.15 58.53,49.16 58.51,49.17 58.49,49.18 58.47,49.19 58.46,49.19 58.44,49.2 58.42,49.21 58.4,49.22 58.38,49.22 58.36,49.23 58.34,49.23 58.32,49.24 58.3,49.24 58.28,49.25 58.26,49.25 58.24,49.25 58.22,49.25 58.19,49.25 58.17,49.26 58.15,49.26 58.13,49.26 58.11,49.26 58.09,49.26 57.97,49.26 57.95,49.26 57.93,49.26 57.91,49.26 57.88,49.26 57.86,49.26 57.84,49.26 57.82,49.26 57.8,49.26 57.78,49.26 57.76,49.25 57.74,49.25 57.72,49.25 57.7,49.25 57.68,49.25 57.66,49.25 57.64,49.25 57.62,49.25 57.6,49.25 57.58,49.24 57.56,49.23 57.55,49.22 57.53,49.21 57.51,49.2 57.5,49.19 57.48,49.18 57.46,49.17 57.44,49.15 57.43,49.14 57.43,49.26
N$70
  pour Top: 283 corners
N$71
  pour Top: 697 corners
N$72
  pour Top: 607 corners
N$73
  pour Top: 515 corners
N$74
  pour Bottom: 7.58,14.8 7.54,14.77 7.5,14.75 7.42,14.69 7.38,14.67 7.33,14.64 7.29,14.61 7.25,14.59 7.21,14.56 7.17,14.54 7.13,14.51 7.09,14.48 7.04,14.46 7,14.43 6.96,14.4 6.92,14.38 6.88,14.35 6.84,14.32 6.82,14.35 6.79,14.37 6.77,14.38 6.73,14.39 6.7,14.4 6.65,14.39 6.61,14.38 6.57,14.35 6.54,14.32 6.52,14.28 6.51,14.24 6.51,14.19 6.52,14.14 6.55,14.1 6.57,14.08 6.6,14.06 6.64,14.05 6.65,14.01 6.65,13.99 6.65,13.96 6.67,13.92 6.69,13.89 6.72,13.87 6.76,13.85 6.8,13.84 6.85,13.84 6.9,13.86 6.94,13.88 6.97,13.92 6.99,13.96 7,14.01 7,14.06 6.99,14.1 6.98,14.12 6.99,14.13 7.02,14.16 7.06,14.19 7.1,14.22 7.14,14.25 7.17,14.28 7.21,14.31 7.25,14.34 7.28,14.37 7.32,14.4 7.36,14.43 7.4,14.46 7.43,14.49 7.47,14.52 7.51,14.56 7.54,14.59 7.58,14.62 7.62,14.65 7.65,14.68 7.63,14.72 7.61,14.76
N$75
  pour Bottom: 9.6,14.85 8.96,14.85 8.97,14.84 9,14.8 8.99,14.8 8.95,14.8 8.91,14.8 8.87,14.8 8.83,14.8 8.78,14.8 8.74,14.8 8.69,14.8 8.64,14.81 8.6,14.81 8.63,14.84 8.63,14.85 7.62,14.85 7.62,14.85 7.65,14.81 7.67,14.77 7.69,14.73 7.72,14.68 7.75,14.65 7.78,14.61 7.81,14.57 7.85,14.54 7.89,14.51 7.92,14.48 7.96,14.45 8,14.42 8.04,14.39 8.09,14.37 8.13,14.35 8.18,14.33 8.22,14.31 8.22,13.87 8.36,13.87 8.36,13.92 8.36,13.97 8.36,14.02 8.36,14.07 8.36,14.11 8.36,14.16 8.36,14.21 8.36,14.26 8.36,14.31 8.36,14.36 8.36,14.41 8.36,14.46 8.43,14.46 8.43,14.41 8.43,14.36 8.43,14.31 8.43,14.26 8.43,14.21 8.43,14.16 8.43,14.11 8.43,14.07 8.43,14.02 8.43,13.97 8.43,13.92 8.43,13.87 8.53,13.87 8.53,14.41 8.66,14.41 8.66,13.87 8.78,13.87 8.78,14.47 8.87,14.47 8.87,13.87 8.99,13.87 8.99,14.34 9.02,14.34 9.05,14.34 9.07,14.34 9.1,14.34 9.1,14.29 9.1,14.24 9.1,14.2 9.1,14.15 9.1,14.1 9.11,14.06 9.11,14.01 9.11,13.96 9.11,13.92 9.11,13.87 9.24,13.87 9.24,14.43 9.27,14.44 9.29,14.46 9.32,14.49 9.35,14.51 9.39,14.54 9.42,14.57 9.45,14.6 9.47,14.63 9.5,14.67 9.53,14.71 9.55,14.75 9.57,14.79 9.59,14.83
N$76
  pour Bottom: 9.6,14.77 9.58,14.73 9.56,14.68 9.54,14.64 9.58,14.61 9.62,14.59 9.66,14.56 9.7,14.53 9.74,14.5 9.78,14.48 9.81,14.45 9.85,14.42 9.89,14.39 9.93,14.36 9.97,14.34 10.01,14.31 10.05,14.28 10.09,14.25 10.13,14.23 10.21,14.17 10.25,14.14 10.24,14.12 10.23,14.07 10.24,14.02 10.25,13.98 10.27,13.94 10.3,13.91 10.33,13.89 10.37,13.87 10.4,13.87 10.43,13.87 10.48,13.88 10.52,13.9 10.55,13.93 10.58,13.97 10.59,14 10.59,14.04 10.59,14.09 10.61,14.09 10.65,14.11 10.68,14.14 10.7,14.18 10.71,14.21 10.71,14.25 10.71,14.29 10.7,14.33 10.68,14.36 10.65,14.39 10.61,14.41 10.57,14.43 10.52,14.43 10.48,14.43 10.44,14.41 10.4,14.38 10.38,14.35 10.33,14.37 10.29,14.4 10.25,14.42 10.2,14.44 10.16,14.47 10.12,14.49 10.08,14.51 10.03,14.54 9.99,14.56 9.95,14.58 9.9,14.61 9.86,14.63 9.82,14.65 9.78,14.68 9.73,14.7 9.69,14.72 9.65,14.75
N$77
  pour Bottom: 9.68,15.28 9.36,15.39 9.35,15.35 9.34,15.31 9.31,15.27 9.28,15.23 9.24,15.21 9.2,15.19 9.16,15.18 9.13,15.18 9.09,15.18 9.05,15.19 9.02,15.21 8.98,15.23 8.96,15.26 8.93,15.29 8.92,15.34 8.91,15.38 8.9,15.43 8.91,15.46 8.6,15.46 8.6,15.43 8.6,15.39 8.59,15.35 8.57,15.32 8.55,15.27 8.52,15.24 8.48,15.2 8.44,15.17 8.4,15.15 8.35,15.14 8.3,15.13 8.25,15.13 8.21,15.13 8.16,15.15 8.11,15.17 8.07,15.19 8.04,15.23 8.01,15.26 7.98,15.29 7.96,15.33 7.95,15.37 7.95,15.4 7.56,15.31 7.55,15.28 7.55,15.23 7.55,15.18 7.55,15.14 7.56,15.09 7.57,15.04 7.58,14.99 7.59,14.95 7.61,14.9 7.62,14.85 8.63,14.85 8.65,14.88 8.67,14.92 8.7,14.95 8.72,14.99 8.75,15.02 8.77,15.06 8.8,15.1 8.82,15.06 8.85,15.02 8.87,14.98 8.9,14.95 8.92,14.91 8.95,14.87 8.96,14.85 9.6,14.85 9.61,14.87 9.63,14.91 9.64,14.96 9.66,15 9.67,15.05 9.67,15.09 9.68,15.13 9.68,15.18 9.68,15.22 9.68,15.26
N$78
  pour Bottom: 8.59,16.16 8.55,16.16 8.5,16.16 8.45,16.15 8.41,16.14 8.36,16.13 8.31,16.12 8.27,16.11 8.22,16.09 8.18,16.08 8.13,16.06 8.09,16.04 8.05,16.01 8.01,15.99 7.97,15.96 7.93,15.93 7.89,15.9 7.85,15.87 7.82,15.84 7.78,15.8 7.75,15.77 7.72,15.73 7.7,15.69 7.67,15.65 7.65,15.6 7.63,15.56 7.61,15.52 7.59,15.47 7.58,15.42 7.57,15.38 7.56,15.33 7.56,15.31 7.95,15.4 7.94,15.42 7.94,15.46 7.94,15.5 7.95,15.54 7.96,15.59 7.98,15.62 8.01,15.66 8.04,15.69 8.07,15.72 8.1,15.74 8.14,15.76 8.19,15.78 8.22,15.78 8.25,15.79 8.28,15.79 8.32,15.78 8.37,15.78 8.4,15.76 8.44,15.74 8.48,15.72 8.51,15.69 8.54,15.65 8.57,15.61 8.58,15.57 8.6,15.52 8.6,15.47 8.6,15.46 8.91,15.46 8.91,15.47 8.93,15.52 8.95,15.56 8.98,15.59 9.02,15.62 9.06,15.63 9.11,15.64 9.15,15.64 9.2,15.64 9.24,15.62 9.27,15.6 9.31,15.56 9.33,15.53 9.35,15.49 9.36,15.45 9.36,15.4 9.36,15.39 9.68,15.28 9.67,15.31 9.67,15.35 9.66,15.4 9.65,15.45 9.63,15.49 9.61,15.54 9.59,15.58 9.57,15.62 9.55,15.66 9.52,15.7 9.49,15.74 9.46,15.78 9.43,15.82 9.4,15.85 9.36,15.88 9.33,15.91 9.29,15.94 9.25,15.97 9.21,16 9.17,16.02 9.13,16.04 9.09,16.06 9.05,16.08 9,16.1 8.96,16.11 8.91,16.12 8.87,16.13 8.83,16.14 8.78,16.15 8.73,16.16 8.69,16.16 8.64,16.16
N$79
  pour Bottom: 6.82,16.62 6.78,16.61 6.74,16.59 6.7,16.56 6.68,16.52 6.67,16.49 6.66,16.45 6.66,16.4 6.63,16.39 6.6,16.37 6.57,16.34 6.55,16.31 6.54,16.27 6.54,16.24 6.54,16.2 6.55,16.16 6.57,16.12 6.61,16.09 6.64,16.07 6.69,16.06 6.73,16.05 6.77,16.06 6.81,16.08 6.85,16.11 6.87,16.13 6.92,16.11 6.96,16.09 7,16.06 7.04,16.04 7.09,16.01 7.13,15.99 7.17,15.97 7.21,15.94 7.25,15.92 7.3,15.9 7.34,15.87 7.38,15.85 7.43,15.82 7.47,15.8 7.51,15.78 7.55,15.75 7.6,15.73 7.64,15.71 7.66,15.75 7.69,15.79 7.7,15.83 7.67,15.86 7.63,15.89 7.59,15.92 7.55,15.95 7.51,15.97 7.47,16 7.43,16.03 7.39,16.06 7.35,16.09 7.31,16.12 7.27,16.14 7.23,16.17 7.15,16.23 7.12,16.26 7.08,16.29 7.04,16.32 7,16.35 7.01,16.37 7.02,16.41 7.02,16.44 7.02,16.47 7,16.51 6.98,16.55 6.95,16.58 6.91,16.6 6.86,16.61
N$80
  pour Bottom: 10.36,16.67 10.31,16.66 10.27,16.64 10.24,16.62 10.21,16.58 10.19,16.54 10.18,16.5 10.18,16.46 10.19,16.41 10.21,16.38 10.17,16.36 10.13,16.33 10.1,16.3 10.06,16.27 10.02,16.24 9.99,16.21 9.95,16.18 9.91,16.15 9.88,16.12 9.84,16.09 9.8,16.06 9.76,16.03 9.73,16 9.69,15.97 9.65,15.93 9.61,15.9 9.57,15.87 9.54,15.84 9.52,15.83 9.54,15.8 9.56,15.77 9.58,15.74 9.6,15.71 9.64,15.74 9.68,15.76 9.73,15.79 9.77,15.82 9.81,15.84 9.85,15.87 9.89,15.9 9.93,15.92 9.97,15.95 10.01,15.97 10.06,16 10.1,16.03 10.14,16.05 10.18,16.08 10.22,16.1 10.26,16.13 10.3,16.16 10.34,16.18 10.36,16.16 10.4,16.14 10.43,16.12 10.48,16.11 10.52,16.11 10.56,16.13 10.6,16.15 10.63,16.18 10.66,16.22 10.67,16.25 10.67,16.29 10.67,16.33 10.66,16.37 10.64,16.4 10.6,16.43 10.56,16.45 10.54,16.46 10.54,16.5 10.53,16.55 10.51,16.59 10.48,16.62 10.44,16.65 10.4,16.66
(copper drawn outside any net)
  shapes: Bottom circle x1, Top circle x6

### Text on the board
Top: heatsynclabs.org
Bottom: heatsynclabs.org
tPlace: <=> | => | A | USB3 | 220pF | R+ | + | R- | GD | 2014 | T+ | T- | G | D+ | 2.0 | D- | V | S | A | B | B | <=> | =>
bPlace: <=> | => | USB3 | R+ | R- | GD | 2014 | T+ | T- | G | D+ | 2.0 | D- | V | S | A | B | <=> | =>